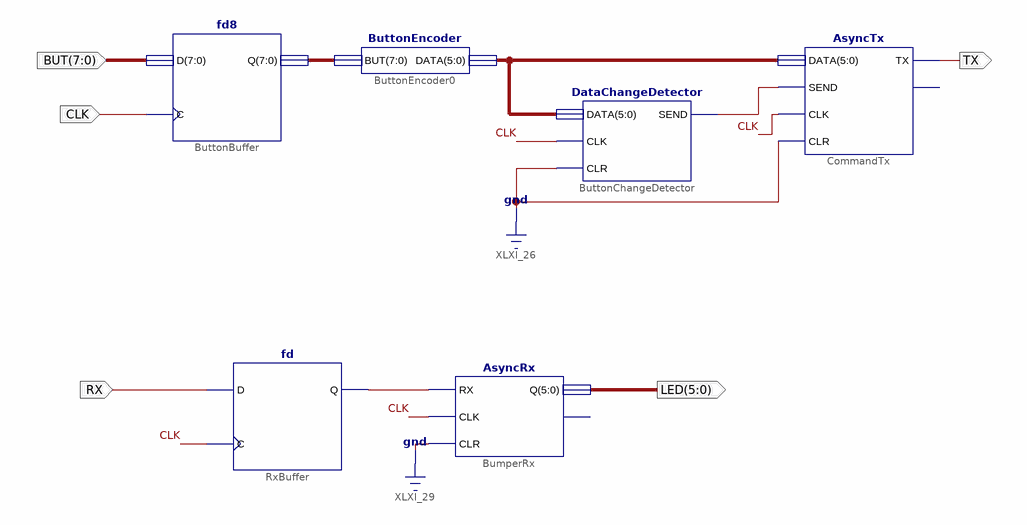
[diagram p0: schematic sheet 1]
// Xilinx ISE schematic HandsetMain.sch (xc9500xl) as structural Verilog: 6 symbols, 5 ports
module HandsetMain (
  input  [7:0] BUT,
  input  RX,
  input  CLK,
  output TX,
  output [5:0] LED
);

  wire XLXN_97, XLXN_101;
  wire [5:0] XLXN_96;
  wire [7:0] XLXN_68;

  fd8 ButtonBuffer (.C(CLK), .D(BUT), .Q(XLXN_68));
  ButtonEncoder ButtonEncoder0 (.BUT(XLXN_68), .DATA(XLXN_96));
  AsyncTx CommandTx (.CLK(CLK), .CLR(1'b0), .DATA(XLXN_96), .SEND(XLXN_97), .TX(TX));  // open: ACTIVE
  DataChangeDetector ButtonChangeDetector (.CLK(CLK), .CLR(1'b0), .DATA(XLXN_96), .SEND(XLXN_97));
  AsyncRx BumperRx (.CLK(CLK), .CLR(1'b0), .Q(LED), .RX(XLXN_101));  // open: UPDATE
  fd RxBuffer (.C(CLK), .D(RX), .Q(XLXN_101));
endmodule
